# EAGLE design Final (EAGLE 7.1.0)
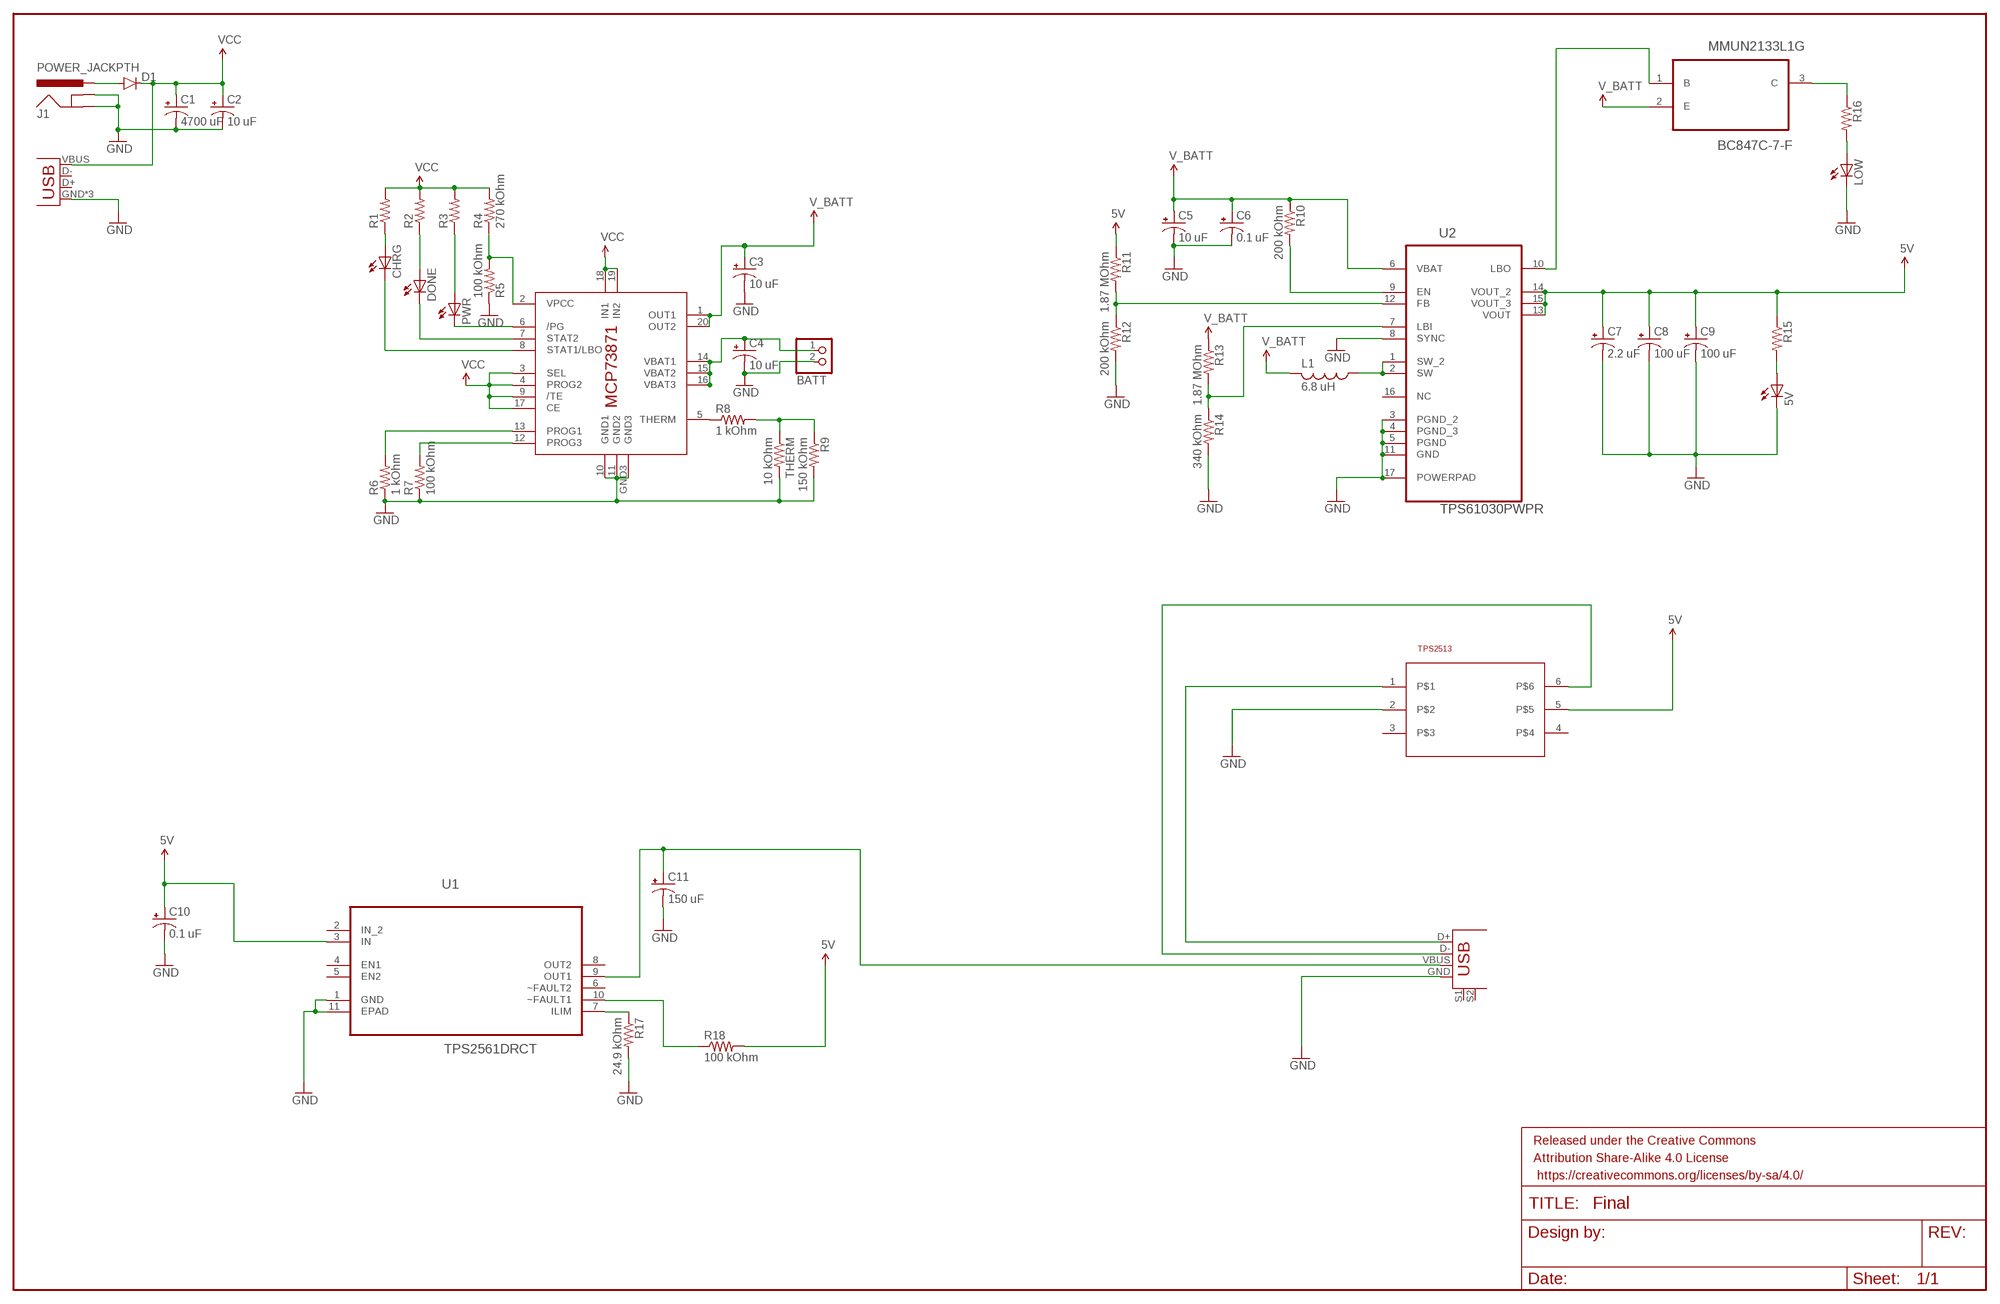
[diagram p0: schematic, sheet 1]

## Parts
5V  LED5MM  [LED5MM]
BATT  JST_2PIN-SMT-RA  [JST-PH-2-SMT-RA]
C1  4700 uF  CPOL-USE7.5-16  [E7,5-16]
C2  10 uF  CPOL-USE2.5-5  [E2,5-5]
C3  10 uF  CPOL-USE2.5-5  [E2,5-5]
C4  10 uF  CPOL-USE2.5-5  [E2,5-5]
C5  10 uF  CPOL-USE2.5-5  [E2,5-5]
C6  0.1 uF  CPOL-USE2.5-5  [E2,5-5]
C7  2.2 uF  CPOL-USE2.5-5  [E2,5-5]
C8  100 uF  CPOL-USE2.5-5  [E2,5-5]
C9  100 uF  CPOL-USE2.5-5  [E2,5-5]
C10  0.1 uF  CPOL-USE2.5-5  [E2,5-5]
C11  150 uF  CPOL-USE2.5-5  [E2,5-5]
CHRG  LED5MM  [LED5MM]
D1  DIODEPTH  [DIODE-1N4001]
DONE  LED5MM  [LED5MM]
FRAME1  FRAME-LEDGER  [CREATIVE_COMMONS]
IC1  MCP73871  [QFN20]
J1  POWER_JACKPTH  [POWER_JACK_PTH]
L1  6.8 uH  L-USLAL03  [LAL03]
LOW  LED5MM  [LED5MM]
MMUN2133L1G  BC847C-7-F  [SOT103P240X110-3N]
PWR  LED5MM  [LED5MM]
R1  R-US_0207/10  [0207/10]
R2  R-US_0207/10  [0207/10]
R3  R-US_0207/10  [0207/10]
R4  270 kOhm  R-US_0207/10  [0207/10]
R5  100 kOhm  R-US_0207/10  [0207/10]
R6  1 kOhm  R-US_0207/10  [0207/10]
R7  100 kOhm  R-US_0207/10  [0207/10]
R8  1 kOhm  R-US_0207/10  [0207/10]
R9  150 kOhm  R-US_0207/10  [0207/10]
R10  200 kOhm  R-US_0207/10  [0207/10]
R11  1.87 MOhm  R-US_0207/10  [0207/10]
R12  200 kOhm  R-US_0207/10  [0207/10]
R13  1.87 MOhm  R-US_0207/10  [0207/10]
R14  340 kOhm  R-US_0207/10  [0207/10]
R15  R-US_0207/10  [0207/10]
R16  R-US_0207/10  [0207/10]
R17  24.9 kOhm  R-US_0207/10  [0207/10]
R18  100 kOhm  R-US_0207/10  [0207/10]
THERM  10 kOhm  R-US_0207/10  [0207/10]
TPS2513  TPS2513  [SOT23-6]
U1  TPS2561DRCT  [SON50P300X300X100-11N]
U2  TPS61030PWPR  [SOP65P640X120-17N]
U3  USB-MICROB  [USB-MICROB]
U$1  USB+SHIELDUSB-A-S-NOSILK-FEMALE  [USB-A-S-NOSILK-FEMALE]

## Nets
5V: C7.+ C8.+ C9.+ C10.+ R11.1 R15.1 R18.2 TPS2513.5 U1.3(IN) U2.13(VOUT) U2.14(VOUT_2) U2.15(VOUT_3)
GND: 5V.K(C) BATT.2 C1.- C2.- C3.- C4.- C5.- C6.- C7.- C8.- C9.- C10.- C11.- IC1.10(GND1) IC1.11(GND2) IC1.GND3 J1.GND J1.GNDBREAK LOW.K(C) R5.1 R6.1 R7.1 R9.2 R12.2 R14.2 R17.2 THERM.2 TPS2513.2 U1.1(GND) U1.11(EPAD) U2.3(PGND_2) U2.4(PGND_3) U2.5(PGND) U2.8(SYNC) U2.11(GND) U2.17(POWERPAD) U3.GND U3.MT1(GND) U3.MT2(GND) U$1.GND
N$1: D1.A J1.PWR
N$2: IC1.2(VPCC) R4.1 R5.2
N$3: BATT.1 C4.+ IC1.14(VBAT1) IC1.15(VBAT2) IC1.16(VBAT3)
N$4: IC1.12(PROG3) R7.2
N$5: CHRG.A R1.1
N$6: DONE.A R2.1
N$7: PWR.A R3.1
N$9: DONE.K(C) IC1.7(STAT2)
N$10: CHRG.K(C) IC1.8(STAT1/LBO)
N$11: IC1.13(PROG1) R6.2
N$12: IC1.5(THERM) R8.1
N$13: R8.2 R9.1 THERM.1
N$14: IC1.6(/PG) PWR.K(C)
N$15: R13.2 R14.1 U2.7(LBI)
N$16: R11.2 R12.1 U2.12(FB)
N$17: 5V.A R15.2
N$18: L1.1 U2.1(SW_2) U2.2(SW)
N$19: R10.2 U2.9(EN)
N$20: MMUN2133L1G.1(B) U2.10(LBO)
N$21: R17.1 U1.7(ILIM)
N$22: MMUN2133L1G.3(C) R16.1
N$23: LOW.A R16.2
N$26: R18.1 U1.10(~FAULT1)
N$27: C11.+ U1.9(OUT1) U$1.VBUS
N$29: TPS2513.1 U$1.D+
N$30: TPS2513.6 U$1.D-
V_BATT: C3.+ C5.+ C6.+ IC1.1(OUT1) IC1.20(OUT2) L1.2 MMUN2133L1G.2(E) R10.1 R13.1 U2.6(VBAT)
VCC: C1.+ C2.+ D1.C IC1.3(SEL) IC1.4(PROG2) IC1.9(/TE) IC1.17(CE) IC1.18(IN1) IC1.19(IN2) R1.2 R2.2 R3.2 R4.2 U3.VBUS
Unconnected: TPS2513.3 TPS2513.4 U1.4(EN1) U1.5(EN2) U1.6(~FAULT2) U1.8(OUT2) U2.16(NC) U3.D+ U3.D- U$1.S1 U$1.S2

## Power pins joined to a net without a drawn wire
IN_2: U1.2(IN_2)

## Library data of the parts
5V CHRG DONE LOW PWR = adafruit:LED: LED OSRAM: - CHIPLED LG R971, LG N971, LY N971, LG Q971, LY Q971, LO R971, LY R971 LH N974, LH R974 LS Q976, LO Q976, LY Q976 LO Q996 - Hyper CHIPLED LW Q18S LB Q993, LB Q99A, LB R99A - SideLED LS A670, LO A670, LY A670, LG A670, LP A670 LB A673, LV A673, LT A673, LW A673 LH A674 LY A675 LS A676, LA A676, LO A676, LY A676, LW A676 LS A679, LY A679, LG A679 - Hyper Micro SIDELED® LS Y876, LA Y876, LO Y876, LY Y876 LT Y87S - SmartLED LW L88C, LW L88S LB L89C, LB L89S, LG L890 LS L89K, LO L89K, LY L89K LS L896, LA L896, LO L896, LY L896 - TOPLED LS T670, LO T670, LY T670, LG T670, LP T670 LSG T670, LSP T670, LSY T670, LOP T670, LYG T670 LG T671, LOG T671, LSG T671 LB T673, LV T673, LT T673, LW T673 LH T674 LS T676, LA T676, LO T676, LY T676, LB T676, LH T676, LSB T676, LW T676 LB T67C, LV T67C, LT T67C, LS T67K, LO T67K, LY T67K, LW E67C LS E67B, LA E67B, LO E67B, LY E67B, LB E67C, LV E67C, LT E67C LW T67C LS T679, LY T679, LG T679 LS T770, LO T770, LY T770, LG T770, LP T770 LB T773, LV T773, LT T773, LW T773 LH T774 LS E675, LA E675, LY E675, LS T675 LS T776, LA T776, LO T776, LY T776, LB T776 LHGB T686 LT T68C, LB T68C - Hyper Mini TOPLED® LB M676 - Mini TOPLED Santana® LG M470 LS M47K, LO M47K, LY M47K Source: http://www.osram.convergy.de/
BATT = adafruit:JST_2PIN: JST 2-Pin Connectors of various flavors SMT-RA (S2B-PH-SM4) 4UConnector #17311 SMT (B2B-PH-SM4) THM-RA (S2B-PH) THM (B2B-PH)
C1-C11 = adafruit:CPOL-US: POLARIZED CAPACITOR, American symbol
D1 = SparkFun-DiscreteSemi:DIODE: Diode These are standard reverse protection diodes and small signal diodes. SMA package can handle up to about 1A. SOD-323 can handle about 200mA. What the SOD-323 package when ordering, there are some mfgs out there that are 5-pin packages.
FRAME1 = SparkFun-Aesthetics:FRAME-LEDGER: Schematic Frame Standard 11x14 US Ledger frame
IC1 = adafruit:MCP73871
J1 = SparkFun-Connectors:POWER_JACK: Power Jack This is the standard 5.5mm barrel jack for power. The PTH is the most common, proven, reliable, footprint. The Slot footprint only works if the mill layer is transmitted to the PCB fab house so be warned. Mating wall wart : TOL-00298 (and others); PROD_ID: PRT-00119
L1 = rcl:L-US: INDUCTOR, American symbol
MMUN2133L1G = Diodes_Inc_By_element14_Batch_1:BC847C-7-F: NPN SURFACE MOUNT SMALL SIGNAL TRANSISTOR; MPN: BC847C-7-F; OC_FARNELL: 1773609; OC_NEWARK: 51R6395; PACKAGE: SOT-23-3; SUPPLIER: DIODES INC.
R1-R18 THERM = adafruit:R-US_: RESISTOR, American symbol
TPS2513 = TPS2513:TPS2513
U1 = Texas Instruments_By_element14_Batch_1:TPS2561DRCT: DUAL CHANNEL PRECISION ADJUSTABLE CURRENT-LIMITED POWER SWITCHES; MPN: TPS2561DRCT; OC_FARNELL: 1815767; OC_NEWARK: 60R2438; PACKAGE: SON-10; SUPPLIER: Texas Instruments
U2 = TPS61230:TPS61030PWPR: 96% EFFICIENT SYNCHRONOUS BOOST CONVERTER WITH 4A SWITCH; MPN: TPS61030PWPR; OC_FARNELL: -; OC_NEWARK: 32H6564; PACKAGE: HTSSOP-16; SUPPLIER: TEXAS INSTRUMENTS
U3 = SparkFun-Connectors:USB: USB Connectors USB-B-PTH is fully proven SKU : PRT-00139/CONN-08278 USB-miniB is fully proven SKU : PRT-00587 USB-A-PCB is untested. USB-A-H is throughly reviewed, but untested. Spark Fun Electronics SKU : PRT-00437 USB-B-SMT is throughly reviewed, but untested. Needs silkscreen touching up. USB-A-S has not been used/tested USB-MB-H has not been used/tested USB-MICROB has been used. CONN-09505; PROD_ID: CONN-09505
U$1 = SparkFun-Connectors:USB+SHIELD: USB+Shield USB connector with shield pins connectable

## Board
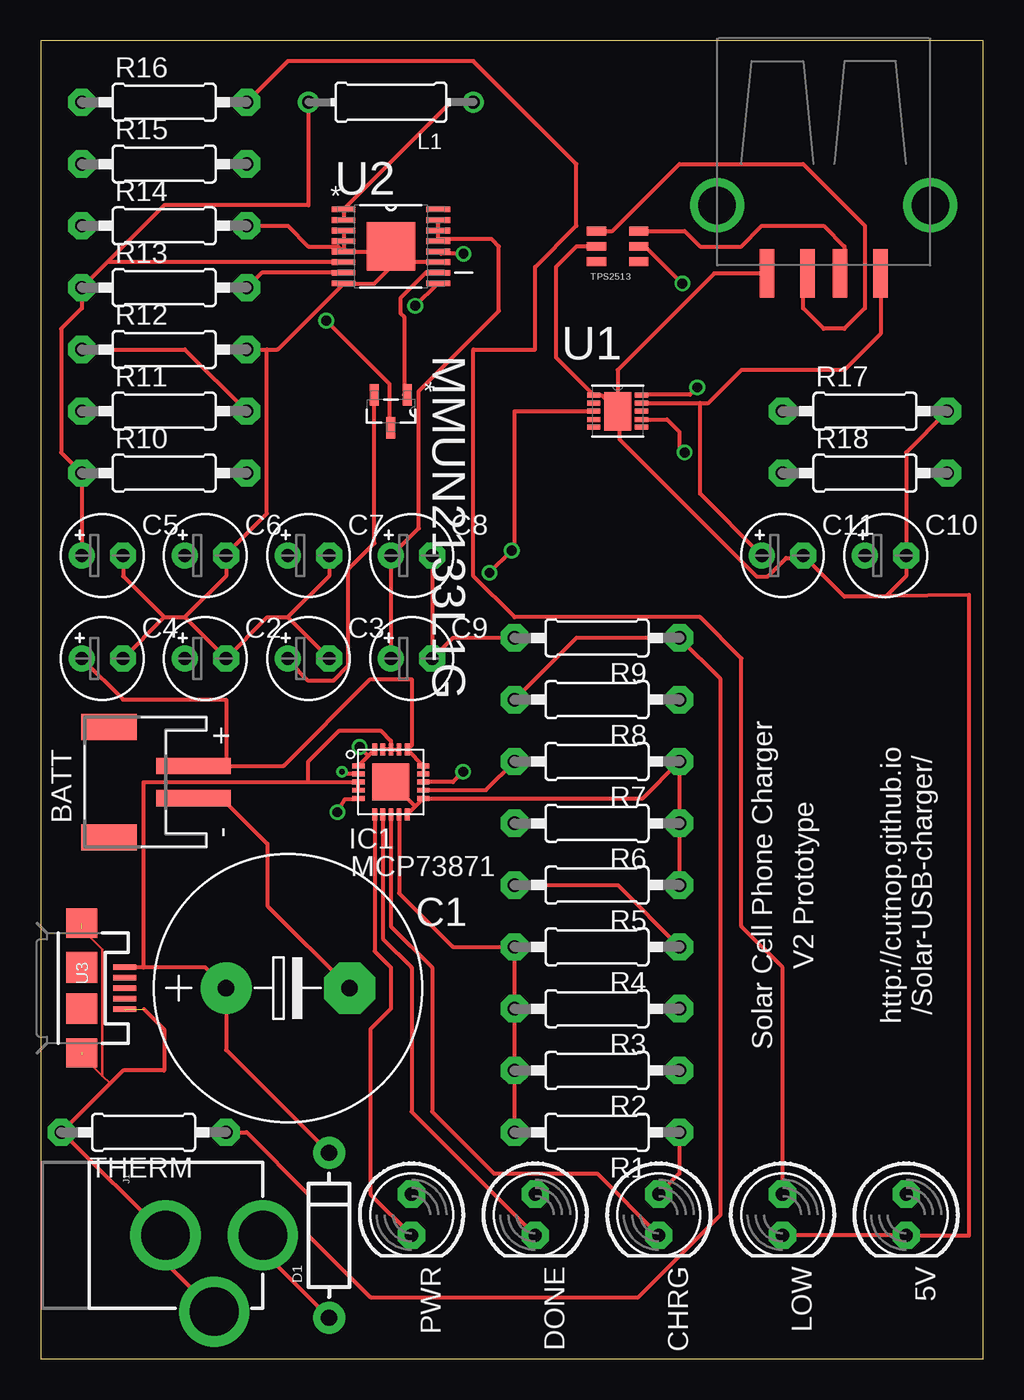
[diagram p1: board, top side]
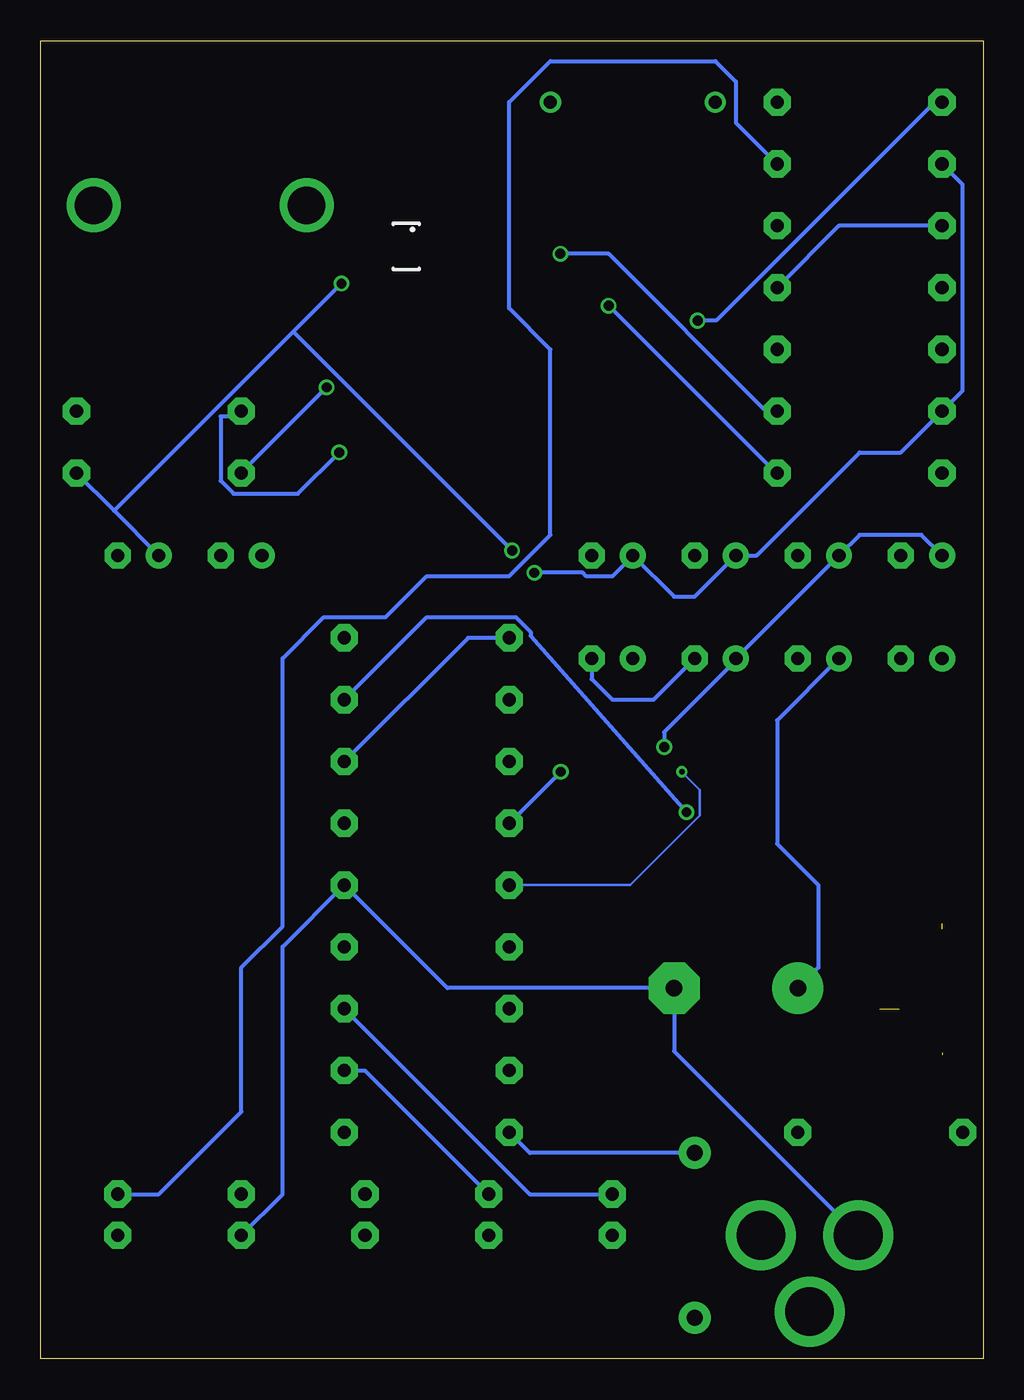
[diagram p2: board, bottom side, seen from below]

Size 58.09 x 81.27 mm. Coordinates in mm from the lower left corner, seen from the top.
Outline: 0,0 58.09,0 58.09,81.27 0,81.27 0,0
Copper layers (1*16): Top 0.0356mm / dielectric 1.5011mm / Bottom 0.0356mm
Design rules "LaenPCBOrder": minimum track width 6mil, minimum drill 13mil, track to track 6mil, track to pad 6mil, pad to pad 6mil, via to via 6mil, smd to smd 6mil, copper to edge 15mil, drill to drill 6mil, minimum pad ring 7mil, minimum via ring 7mil, stop-mask expansion 3mil, vias tented up to drill 0mil, thermal gap 10mil

### Footprints (pad centres in the part's own frame; a part is rotated, then mirrored left to right if it is on the bottom)
LED5MM = drill 0.813 pad 1.676 octagon: A -1.27,0; K 1.27,0
JST-PH-2-SMT-RA = smd 1 x 4.6: 1 1,-3.7; 2 -1,-3.7 | smd 1.6 x 3.4: NC1 -3.4,1.5; NC2 3.4,1.5
E7,5-16 = drill 1.016 pad 3.15: + -3.81,0 | drill 1.016 pad 3.15 octagon: - 3.81,0
E2,5-5 = drill 0.813 pad 1.6: + -1.27,0 | drill 0.813 pad 1.6 octagon: - 1.27,0
DIODE-1N4001 = drill 1 pad 1.981: A -5.08,0; C 5.08,0
QFN20 = smd 0.75 x 0.3: 1 -2,1; 2 -2,0.5; 3 -2,0; 4 -2,-0.5; 5 -2,-1; 11 2,-1; 12 2,-0.5; 13 2,0; 14 2,0.5; 15 2,1 | smd 0.3 x 0.75: 6 -1,-2; 7 -0.5,-2; 8 0,-2; 9 0.5,-2; 10 1,-2; 16 1,2; 17 0.5,2; 18 0,2; 19 -0.5,2; 20 -1,2 | smd 2.286 x 2.286: GND3 0,0
POWER_JACK_PTH = drill 2.997 pad 4.318: GND 0,7.7; GNDBREAK 4.7,10.7; PWR 0,13.7
LAL03 = drill 0.8 pad 1.3: 1 -5.08,0; 2 5.08,0
SOT103P240X110-3N = smd 1.321 x 0.559: 1 -1.016,1.016; 2 -1.016,-1.016; 3 1.016,0
0207/10 = drill 0.813 pad 1.676 octagon: 1 -5.08,0; 2 5.08,0
SOT23-6 = smd 1.2 x 0.55: 1 -1.3,0.95; 2 -1.3,0; 3 -1.3,-0.95; 4 1.3,-0.95; 5 1.3,0; 6 1.3,0.95
SON50P300X300X100-11N = smd 0.813 x 0.305: 1 -1.473,0.991; 2 -1.473,0.508; 3 -1.473,0; 4 -1.473,-0.508; 5 -1.473,-0.991; 6 1.473,-0.991; 7 1.473,-0.508; 8 1.473,0; 9 1.473,0.508; 10 1.473,0.991 | smd 1.651 x 2.388: 11 0,0
SOP65P640X120-17N = smd 1.473 x 0.356: 1 -2.921,2.286; 2 -2.921,1.626; 3 -2.921,0.965; 4 -2.921,0.33; 5 -2.921,-0.33; 6 -2.921,-0.965; 7 -2.921,-1.626; 8 -2.921,-2.286; 9 2.921,-2.286; 10 2.921,-1.626; 11 2.921,-0.965; 12 2.921,-0.33; 13 2.921,0.33; 14 2.921,0.965; 15 2.921,1.626; 16 2.921,2.286 | smd 2.997 x 2.997: 17 0,0
USB-MICROB = smd 0.35 x 1.4: D+ 0,2.65; D- -0.65,2.65; GND 1.3,2.65; ID 0.65,2.65; VBUS -1.3,2.65 | smd 1.8 x 1.9: MT1 -4,0; MT2 4,0 | smd 1.9 x 1.9: P$1 -1.27,0; P$2 1.27,0
USB-A-S-NOSILK-FEMALE = smd 3 x 0.9: D+ 4.212,-1; D- 4.212,1; GND 4.212,-3.5; VBUS 4.212,3.5 | drill 2.311: S1 0,-6.566; S2 0,6.566

### Placement (x,y rotation side)
5V  53.34,8.89 270 top
BATT  5.71,35.56 90 top
C1  15.24,22.86 0 top
C2  10.16,43.18 0 top
C3  16.51,43.18 0 top
C4  3.81,43.18 0 top
C5  3.81,49.53 0 top
C6  10.16,49.53 0 top
C7  16.51,49.53 0 top
C8  22.86,49.53 0 top
C9  22.86,43.18 0 top
C10  52.07,49.53 0 top
C11  45.72,49.53 0 top
CHRG  38.1,8.89 270 top
D1  17.78,7.62 90 top
DONE  30.48,8.89 270 top
FRAME1  -78.74,41.91 0 top  (outside the outline)
IC1  21.59,35.56 0 top
J1  0,7.62 270 top
L1  21.59,77.47 180 top
LOW  45.72,8.89 270 top
MMUN2133L1G  21.59,58.42 270 top
PWR  22.86,8.89 270 top
R1  34.29,13.97 180 top
R2  34.29,17.78 180 top
R3  34.29,21.59 180 top
R4  34.29,25.4 180 top
R5  34.29,29.21 180 top
R6  34.29,33.02 180 top
R7  34.29,36.83 180 top
R8  34.29,40.64 180 top
R9  34.29,44.45 180 top
R10  7.62,54.61 0 top
R11  7.62,58.42 0 top
R12  7.62,62.23 0 top
R13  7.62,66.04 0 top
R14  7.62,69.85 0 top
R15  7.62,73.66 0 top
R16  7.62,77.47 0 top
R17  50.8,58.42 0 top
R18  50.8,54.61 0 top
THERM  6.35,13.97 180 top
TPS2513  35.56,68.58 0 top
U1  35.56,58.42 0 top
U2  21.59,68.58 0 top
U3  2.54,22.86 270 top
U$1  48.26,71.12 270 top

### Tracks (layer width: path | path; a pad name or v marks a point on that pad's centre or on a via)
5V  (via drill 0.61)
  Top 0.254: C9.+ C8.+ 21.72,49.61 23.32,51.21 23.32,59.66 28.25,64.59 28.25,68.58 27.79,69.04 24.69,69.04 U2.13 U2.14 U2.15 | TPS2513.5 37.26,68.58 v39.55,66.29 | v27.66,48.46 v29.03,49.84 29.21,50.16 29.21,58.42 U1.3 34.29,58.42
  Bottom 0.254: R15.1 1.27,72.39 1.27,59.69 R11.1 5.08,55.88 7.62,55.88 13.97,49.53 C7.+ 17.78,46.99 19.05,46.99 C8.+ 21.72,49.38 22.86,48.23 24.46,48.23 24.69,48.46 v27.66,48.46 | C10.+ 53.56,52.29 | 53.56,52.29 R18.2 | 53.56,52.29 42.52,63.32 | 42.52,63.32 v39.55,66.29 | v29.03,49.84 42.52,63.32
GND  (3 unrouted)
  Top 0.152: 4.29,16.99 3.81,17.46 | 3.81,17.46 2.54,18.73 | 2.54,26.51 3.81,25.24 3.81,17.46
  Top 0.254: 23.09,34.06 IC1.11 37.1,34.56 R7.1 R6.1 R5.1 | 23.09,34.06 IC1.10 | IC1.GND3 23.09,34.06 | C4.- 7.62,45.72 | 7.62,45.72 8.89,45.72 | 8.89,45.72 C2.- 13.97,45.72 15.24,45.72 | 15.24,45.72 C3.- | 6.38,21.56 7.62,20.32 7.62,17.78 5.08,17.78 4.29,16.99 THERM.2 1.35,13.97 J1.GND 7.7,5.92 J1.GNDBREAK | BATT.2 11.16,34.56 13.97,31.75 13.97,27.94 C1.- | R9.2 25.4,44.45 C9.- C8.- | C5.- 5.08,48.26 7.62,45.72 | 8.89,45.72 11.43,48.26 C6.- 11.43,49.61 13.95,52.12 13.95,62.23 | C7.- 17.78,48.26 15.24,45.72 | U2.3 U2.4 U2.5 | 21.26,69.52 U2.17 | 20.57,67.56 U2.17 | 22.55,68.89 U2.17 | U2.5 21.26,68.25 U2.17 | U2.17 21.59,67.31 20.57,66.29 U2.8 14.61,62.23 13.95,62.23 | U2.11 22.55,67.61 U2.17 | LOW.K 5V.K 57.23,7.62 57.23,47.09 49.52,47 | R14.2 15.24,69.85 16.51,68.58 18.34,68.58 U2.5 | R12.2 13.95,62.23 | TPS2513.2 33.02,68.58 31.75,67.31 31.75,61.75 U1.1 34.57,59.41 U1.11 | U$1.GND 41.51,66.91 35.56,60.96 U1.11 | R17.2 53.34,55.88 C10.- 53.34,48.26 52.07,46.99 49.53,46.99 49.52,47 | 49.52,47 C11.- 46.86,49.38 45.95,49.38 44.81,48.23 44.12,48.23 35.66,56.69 35.66,58.29 U1.11
  Bottom 0.254: R7.1 31.75,44.45 R9.2 | J1.GND 19.05,18.97 C1.- 33.02,22.86 R5.1 43.18,25.4 43.18,10.16 LOW.K | C9.- 24.13,41.91 22.86,40.64 20.32,40.64 C3.-
N$1
  Top 0.254: J1.PWR 13.7,6.62 D1.A
N$2  (via drill 0.33)
  Top 0.152: v18.57,36.2 18.57,36.06 18.57,36.04
  Top 0.254: R5.2 35.56,29.21 R4.1 | IC1.2 18.57,36.06 18.55,36.06
  Bottom 0.152: v18.57,36.2 17.46,35.08 17.46,33.5 21.75,29.21 R5.2
N$3
  Top 0.254: IC1.14 IC1.15 IC1.16 22.86,37.83 22.86,41.91 20.32,41.91 14.97,36.56 11.43,36.56 | BATT.1 11.43,36.56 | C4.+ 5.08,40.64 11.43,40.64 11.43,36.56
N$4
  Top 0.254: IC1.12 27.44,35.06 R7.2
N$5
  Top 0.254: R1.1 39.37,11.43 CHRG.A
N$6
  Bottom 0.254: R2.1 38.1,17.78 DONE.A
N$7
  Bottom 0.254: R3.1 27.94,10.16 PWR.A
N$9
  Top 0.254: IC1.7 21.09,25.9 22.86,24.13 22.86,15.24 DONE.K
N$10
  Top 0.254: IC1.8 21.59,26.67 24.13,24.13 24.13,15.24 27.94,11.43 34.29,11.43 CHRG.K
N$11  (via drill 0.61)
  Top 0.254: v26.04,36.2 25.4,35.56 IC1.13 23.5,35.56
  Bottom 0.254: R6.2 v26.04,36.2
N$12  (via drill 0.61)
  Top 0.254: v18.29,33.71 18.75,34.52 19.43,34.52 IC1.5
  Bottom 0.254: v18.29,33.71 27.89,44.58 27.89,44.81 28.8,45.72 34.29,45.72 R8.1
N$13
  Top 0.254: R8.2 33.02,44.45 R9.1 41.91,41.91 41.91,8.89 36.83,3.81 20.32,3.81 16.51,7.62 16.51,10.16 12.7,13.97 THERM.1
N$14
  Top 0.254: IC1.6 20.59,25.13 21.59,24.13 21.59,21.59 20.32,20.32 20.32,10.16 PWR.K
N$15
  Top 0.254: U2.7 13.61,66.95 R13.2
  Bottom 0.254: R14.1 8.89,69.85 R13.2
N$16  (via drill 0.61)
  Top 0.254: R12.1 8.89,62.23 R11.2 | v26.06,68.12 24.69,68.12 U2.12
  Bottom 0.254: v26.06,68.12 23.09,68.12 13.49,58.52 12.8,58.52 R11.2
N$17
  Bottom 0.254: 5V.A 50.8,10.16 45.72,15.24 45.72,24.13 43.18,26.67 43.18,43.18 40.64,45.72 36.83,45.72 34.29,48.26 29.21,48.26 26.67,50.8 26.67,62.23 29.21,64.77 29.21,77.47 26.67,80.01 16.51,80.01 15.24,78.74 15.24,76.2 R15.2
N$18
  Top 0.254: U2.2 U2.1 25.27,77.47 L1.1
N$19  (via drill 0.61)
  Top 0.254: v23.09,64.92 24.46,66.29 U2.9
  Bottom 0.254: v23.09,64.92 12.8,54.63 R10.2
N$20
  Top 0.254: MMUN2133L1G.1 22.4,59.44 22.4,64.24 22.17,64.47 22.17,65.38 23.77,66.98 24.46,66.98 U2.10
N$21  (via drill 0.61)
  Top 0.254: U1.7 38.61,57.91 39.37,57.15 39.37,55.88 v39.69,55.88
  Bottom 0.254: v39.69,55.88 42.23,53.34 46.2,53.34 46.99,54.13 46.99,58.1 46.04,58.1 R17.1
N$22  (via drill 0.61)
  Top 0.254: v17.6,64.01 21.49,60.12 21.49,57.61 MMUN2133L1G.3
  Bottom 0.254: v17.6,64.01 16.46,64.01 3.2,77.27 2.74,77.27 R16.1
N$23
  Top 0.254: LOW.A 45.72,24.13 43.18,26.67 43.18,43.18 40.64,45.72 29.21,45.72 26.67,48.26 26.67,62.23 30.48,62.23 30.48,67.31 33.02,69.85 33.02,73.66 26.67,80.01 15.24,80.01 R16.2
N$26  (via drill 0.61)
  Top 0.254: v40.46,59.89 40.01,59.44 37.03,59.44 U1.10
  Bottom 0.254: R18.1 45.72,54.63 v40.46,59.89
N$27
  Top 0.254: U$1.VBUS 51.76,63.19 49.53,60.96 43.18,60.96 41.15,58.93 40.64,58.93 | U1.9 40.64,58.93 | C11.+ 40.64,53.34 40.64,58.93
N$29
  Top 0.254: TPS2513.1 35.24,69.53 39.37,73.66 46.99,73.66 50.8,69.85 50.8,64.77 49.53,63.5 48.26,63.5 46.99,64.77 46.99,66.64 U$1.D+
N$30
  Top 0.254: TPS2513.6 39.69,69.53 40.64,68.58 43.18,68.58 44.45,69.85 48.26,69.85 49.53,68.58 49.53,67.18 U$1.D-
V_BATT  (via drill 0.61)
  Top 0.254: IC1.20 20.2,37.17 | 20.2,37.17 IC1.1 | v19.66,37.72 20.2,37.17 | C5.+ R10.1 1.27,55.88 1.27,63.5 2.54,64.77 R13.1 4.12,67.61 | U2.6 4.12,67.61 | L1.2 16.51,71.12 7.62,71.12 4.12,67.61 | MMUN2133L1G.2 20.57,50.29 18.97,48.69 18.97,42.75 18.06,41.83 16.46,41.83 15.32,42.98 C3.+
  Bottom 0.254: v19.66,37.72 19.66,38.63 15.32,42.98 C3.+ C6.+ 7.62,50.8 3.81,50.8 C5.+
VCC
  Top 0.254: IC1.4 IC1.3 | IC1.18 IC1.17 | IC1.18 IC1.19 | IC1.9 22.09,28.71 25.4,25.4 R4.2 R3.2 R2.2 R1.2 | D1.C 11.43,19.05 C1.+ 10.13,24.16 6.35,24.16 | U3.VBUS 6.35,24.16 | 16.51,35.56 6.35,35.56 6.35,24.16 | 16.51,35.56 IC1.3 | 19.68,35.56 IC1.3 | 6.35,24.13 6.35,24.16 | IC1.18 21.59,38.1 20.95,38.73 18.41,38.73 16.51,36.83 16.51,35.56 | 21.59,37.47 IC1.18
  Bottom 0.254: D1.C 27.94,12.7 R1.2 | C2.+ 12.7,39.37 12.7,31.75 10.16,29.21 10.16,24.13 C1.+

### Text on the board
tNames: Solar Cell Phone Charger | V2 Prototype | http://cutnop.github.io / /Solar-USB-charger/